# EAGLE design mariokard_v2 (EAGLE 7.2.0)
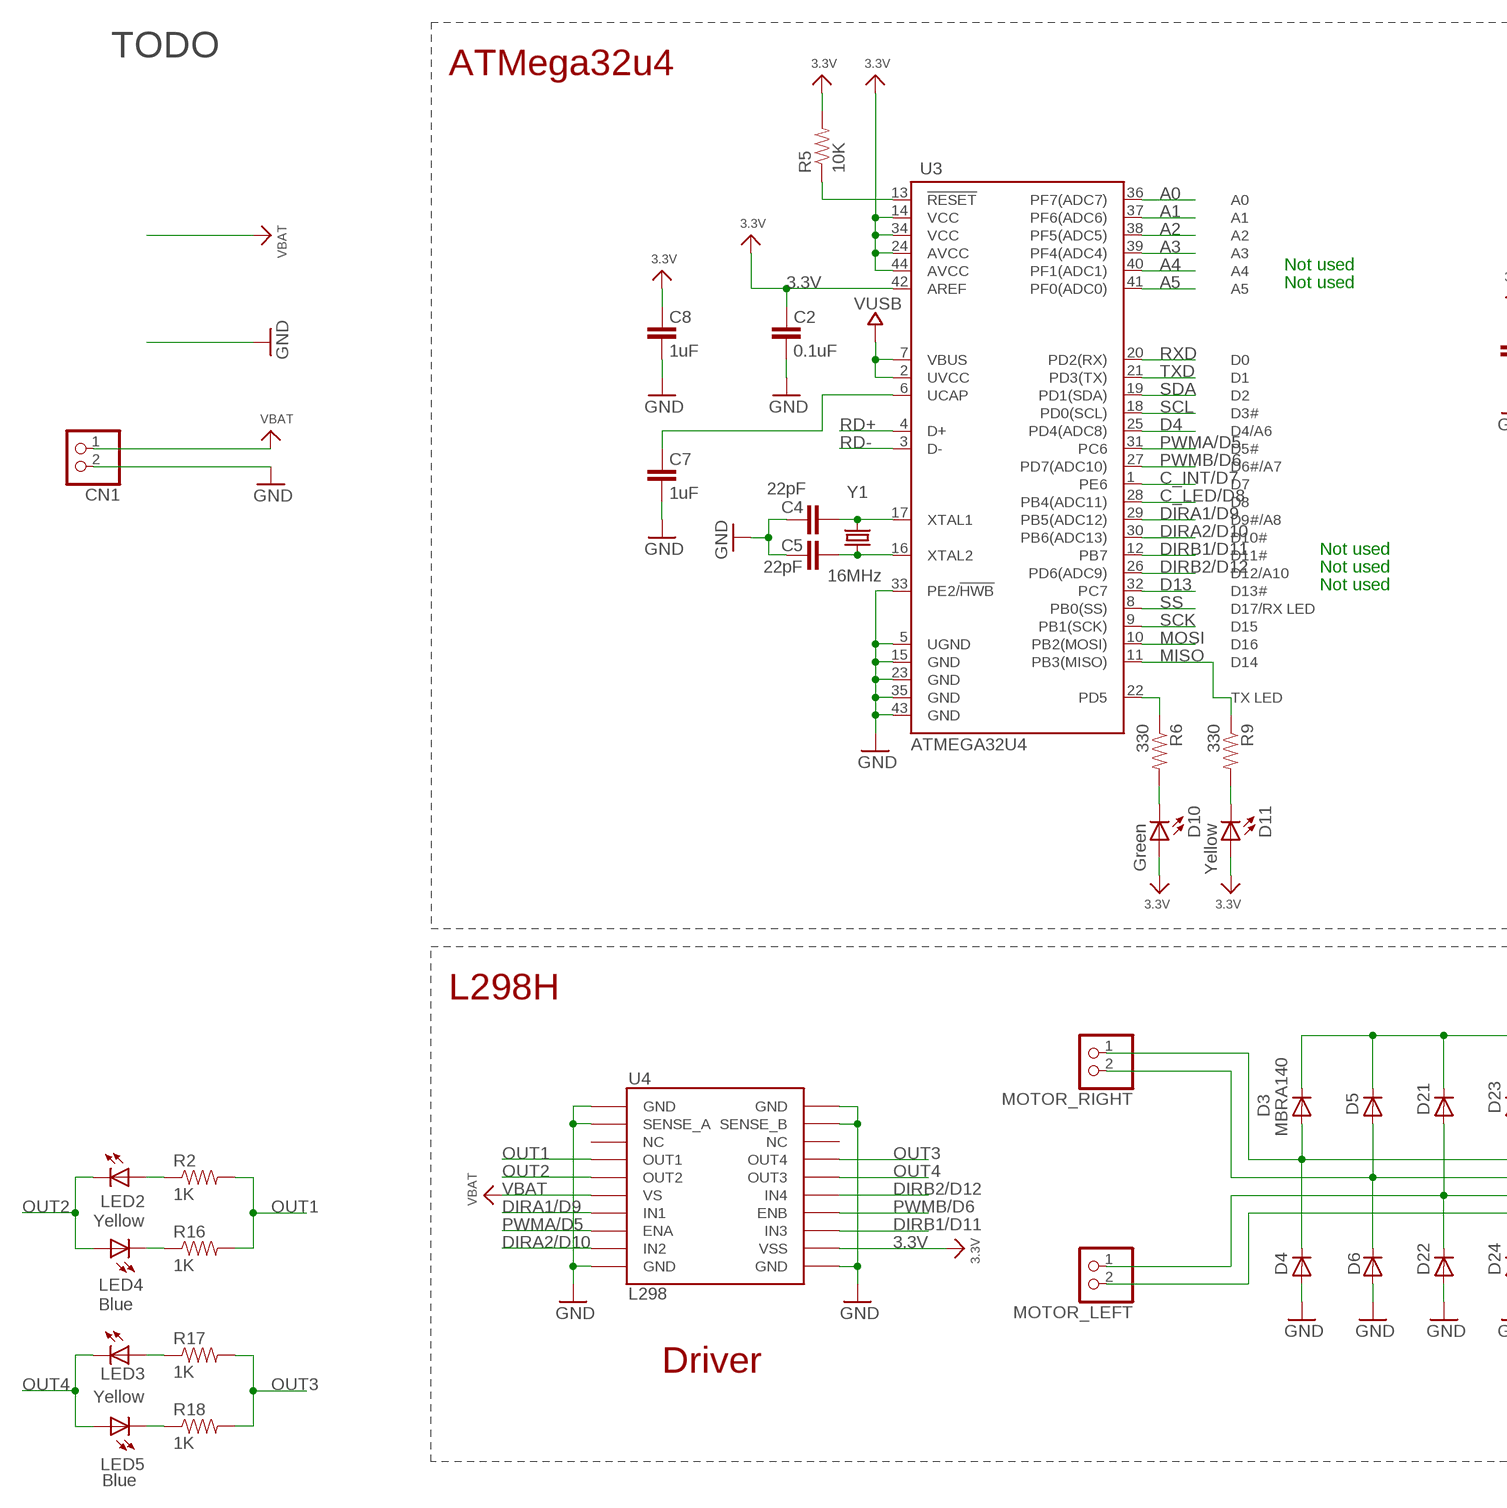
[diagram p0: schematic, sheet 1, part 1 of 2]
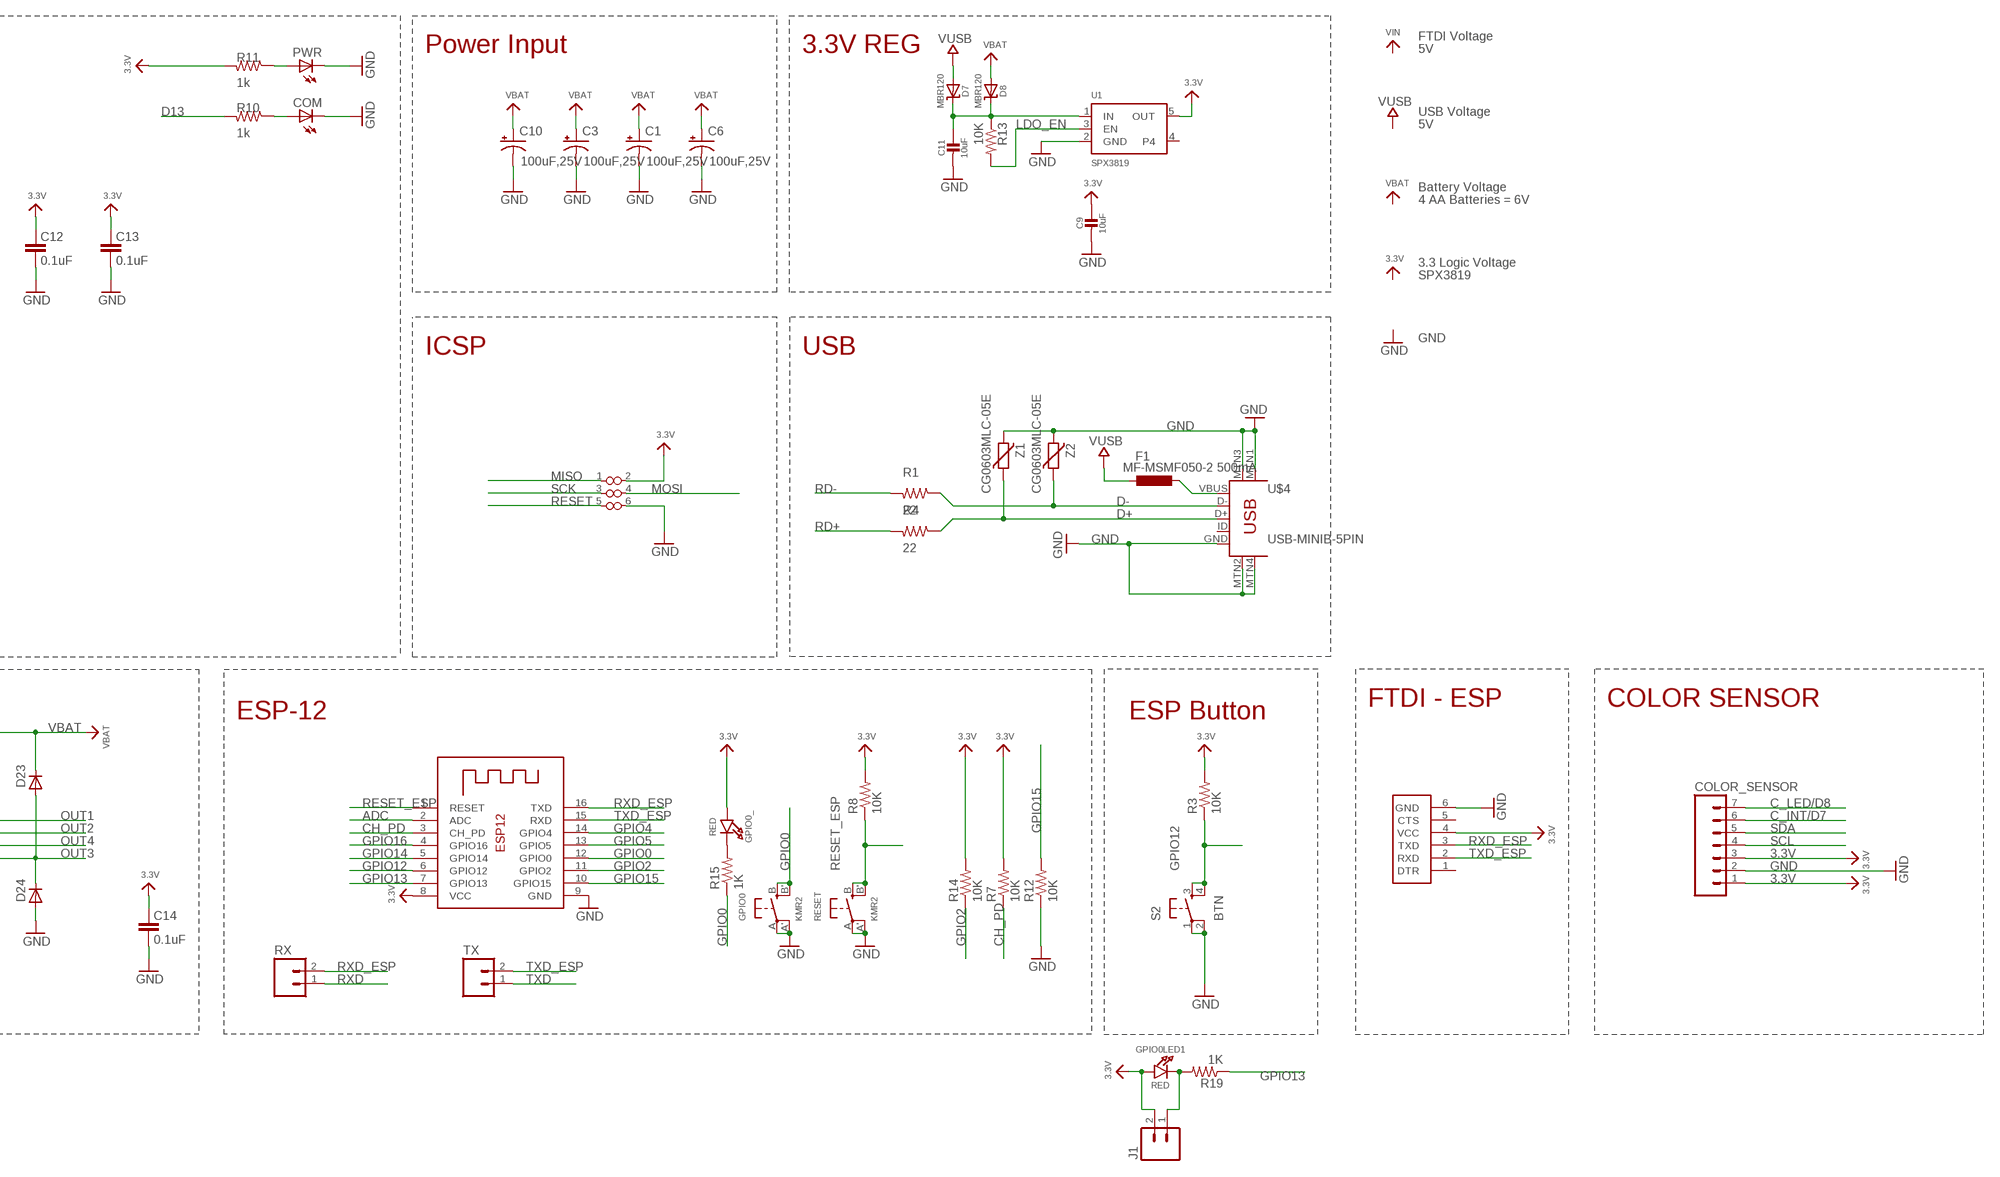
[diagram p1: schematic, sheet 1, part 2 of 2]

## Parts
C1  100uF,25V  CAP_POLF80  [NIPPON_F80]
C2  0.1uF  CAP0603-CAP  [0603-CAP]
C3  100uF,25V  CAP_POLF80  [NIPPON_F80]
C4  22pF  CAP0603-CAP  [0603-CAP]
C5  22pF  CAP0603-CAP  [0603-CAP]
C6  100uF,25V  CAP_POLF80  [NIPPON_F80]
C7  1uF  CAP0603-CAP  [0603-CAP]
C8  1uF  CAP0603-CAP  [0603-CAP]
C9  10uF  CAP_CERAMIC0805-NOOUTLINE  [0805-NO]
C10  100uF,25V  CAP_POLF80  [NIPPON_F80]
C11  10uF  CAP_CERAMIC0805-NOOUTLINE  [0805-NO]
C12  0.1uF  CAP0603-CAP  [0603-CAP]
C13  0.1uF  CAP0603-CAP  [0603-CAP]
C14  0.1uF  CAP0603-CAP  [0603-CAP]
CN1  JST_2PIN-THM  [JST-PH-2-THM]
COLOR_SENSOR  M07  [1X07]
COM  LEDCHIPLED_0603  [CHIPLED_0603]
D3  MBRA140  DIODESMA  [SMA-DIODE]
D4  MBRA140  DIODESMA  [SMA-DIODE]
D5  MBRA140  DIODESMA  [SMA-DIODE]
D6  MBRA140  DIODESMA  [SMA-DIODE]
D7  MBR120  DIODE-SCHOTTKYSOD-123  [SOD-123]
D8  MBR120  DIODE-SCHOTTKYSOD-123  [SOD-123]
D10  Green  LED0603  [LED-0603]
D11  Yellow  LED0603  [LED-0603]
D21  MBRA140  DIODESMA  [SMA-DIODE]
D22  MBRA140  DIODESMA  [SMA-DIODE]
D23  MBRA140  DIODESMA  [SMA-DIODE]
D24  MBRA140  DIODESMA  [SMA-DIODE]
F1  MF-MSMF050-2 500mA  L-EUL1812  [L1812]
FTDI  FTDI_POGO  [FTDI_POGO]
GPIO0  KMR2  SWITCH_TACT_SMT4.6X2.8  [BTN_KMR2_4.6X2.8]
GPIO0_  RED  LED0805_NOOUTLINE  [CHIPLED_0805_NOOUTLINE]
GPIO0LED1  RED  LED0805_NOOUTLINE  [CHIPLED_0805_NOOUTLINE]
ISP  ISP_POGO  [POGO_ISP]
J1  M02PTH  [1X02]
LED2  Yellow  LED0603  [LED-0603]
LED3  Yellow  LED0603  [LED-0603]
LED4  Blue  LED0603  [LED-0603]
LED5  Blue  LED0603  [LED-0603]
MOTOR_LEFT  JST_2PIN-SMT-RA  [JST-PH-2-SMT-RA]
MOTOR_RIGHT  JST_2PIN-SMT-RA  [JST-PH-2-SMT-RA]
PWR  LEDCHIPLED_0603  [CHIPLED_0603]
R1  22  RESISTOR0805-RES  [0805]
R2  1K  RESISTOR0402-RES  [0402-RES]
R3  10K  R-US_R0603  [R0603]
R4  22  RESISTOR0805-RES  [0805]
R5  10K  RESISTOR0603-RES  [0603-RES]
R6  330  RESISTOR0603-RES  [0603-RES]
R7  10K  R-US_R0603  [R0603]
R8  10K  R-US_R0603  [R0603]
R9  330  RESISTOR0603-RES  [0603-RES]
R10  1k  RESISTOR0805-RES  [0805]
R11  1k  RESISTOR0805-RES  [0805]
R12  10K  R-US_R0603  [R0603]
R13  10K  R-US_R0603  [R0603]
R14  10K  R-US_R0603  [R0603]
R15  1K  R-US_R0603  [R0603]
R16  1K  RESISTOR0402-RES  [0402-RES]
R17  1K  RESISTOR0402-RES  [0402-RES]
R18  1K  RESISTOR0402-RES  [0402-RES]
R19  1K  R-US_R0603  [R0603]
RESET  KMR2  SWITCH_TACT_SMT4.6X2.8  [BTN_KMR2_4.6X2.8]
RX  M02PTH  [1X02]
S2  BTN  TAC_SWITCHSMD  [TACTILE-SWITCH-SMD]
TX  M02PTH  [1X02]
U1  SPX3819  VREG_SOT23-5  [SOT23-5]
U3  ATMEGA32U4  ATMEGA32U4TQFP-44  [TQFP44]
U4  L298  L298_BRIDGE_DRIVER  [POWERSO20]
U$4  USB-MINIB-5PIN  [USB-MINIB]
X1  ESP-12  [ESP-12]
Y1  16MHz  CRYSTAL5X3  [CRYSTAL-SMD-5X3]
Z1  CG0603MLC-05E  VARISTORCN0603  [CT/CN0603]
Z2  CG0603MLC-05E  VARISTORCN0603  [CT/CN0603]

## Nets
3.3V: C2.2 C8.2 C9.1 C12.2 C13.2 C14.2 COLOR_SENSOR.1 COLOR_SENSOR.3 D10.A D11.A FTDI.4(VCC) GPIO0_.A GPIO0LED1.A ISP.2(VCC) J1.2 R3.2 R5.2 R7.2 R8.2 R11.2 R14.2 U1.5(OUT) U3.14(VCC) U3.24(AVCC) U3.34(VCC) U3.42(AREF) U3.44(AVCC) U4.P$12(VSS) X1.8(VCC)
A0: U3.36(PF7(ADC7))
A1: U3.37(PF6(ADC6))
A2: U3.38(PF5(ADC5))
A3: U3.39(PF4(ADC4))
A4: U3.40(PF1(ADC1))
A5: U3.41(PF0(ADC0))
ADC: X1.2(ADC)
C_INT/D7: COLOR_SENSOR.6 U3.1(PE6)
C_LED/D8: COLOR_SENSOR.7 U3.28(PB4(ADC11))
CH_PD: R7.1 X1.3(CH_PD)
D4: U3.25(PD4(ADC8))
D13: R10.2 U3.32(PC7)
D+: R4.1 U$4.D+ Z1.1
D-: R1.1 U$4.D- Z2.1
DIRA1/D9: U3.29(PB5(ADC12)) U4.P$7(IN1)
DIRA2/D10: U3.30(PB6(ADC13)) U4.P$9(IN2)
DIRB1/D11: U3.12(PB7) U4.P$13(IN3)
DIRB2/D12: U3.26(PD6(ADC9)) U4.P$15(IN4)
GND: C1.- C2.1 C3.- C4.2 C5.2 C6.- C7.1 C8.1 C9.2 C10.- C11.2 C12.1 C13.1 C14.1 CN1.2 COLOR_SENSOR.2 COM.C D4.A D6.A D22.A D24.A FTDI.6(GND) GPIO0.A'(P1) GPIO0.A(P) ISP.6(GND) PWR.C R12.1 RESET.A'(P1) RESET.A(P) S2.1 S2.2 U1.2(GND) U3.5(UGND) U3.15(GND) U3.23(GND) U3.33(PE2/!HWB) U3.35(GND) U3.43(GND) U4.P$1(GND) U4.P$2(SENSE_A) U4.P$10(GND) U4.P$11(GND) U4.P$19(SENSE_B) U4.P$20(GND) U$4.GND U$4.MTN1(MTN2) U$4.MTN2(MTN3) U$4.MTN3(MTN1) U$4.MTN4 X1.9(GND) Z1.2 Z2.2
GPIO0: GPIO0.B'(S1) GPIO0.B(S) R15.1 X1.12(GPIO0)
GPIO2: R14.1 X1.11(GPIO2)
GPIO4: X1.14(GPIO4)
GPIO5: X1.13(GPIO5)
GPIO12: R3.1 S2.3 S2.4 X1.6(GPIO12)
GPIO13: R19.1 X1.7(GPIO13)
GPIO14: X1.5(GPIO14)
GPIO15: R12.2 X1.10(GPIO15)
GPIO16: X1.4(GPIO16)
LDO_EN: R13.2 U1.3(EN)
MISO: ISP.1(MISO) R9.1 U3.11(PB3(MISO))
MOSI: ISP.4(MOSI) U3.10(PB2(MOSI))
N$1: C5.1 U3.16(XTAL2) Y1.1
N$2: C4.1 U3.17(XTAL1) Y1.3
N$3: C7.2 U3.6(UCAP)
N$4: C11.1 D7.C D8.C R13.1 U1.1(IN)
N$5: LED2.A R2.1
N$6: LED4.C R16.1
N$7: LED5.C R18.1
N$8: LED3.A R17.1
N$9: COM.A R10.1
N$10: PWR.A R11.1
N$11: GPIO0_.C R15.2
N$12: F1.1 U$4.VBUS
N$13: D11.C R9.2
N$14: D10.C R6.2
N$15: GPIO0LED1.C J1.1 R19.2
OUT1: D3.A D4.C MOTOR_RIGHT.1 R2.2 R16.2 U4.P$4(OUT1)
OUT2: D5.A D6.C LED2.C LED4.A MOTOR_RIGHT.2 U4.P$5(OUT2)
OUT3: D23.A D24.C MOTOR_LEFT.2 R17.2 R18.2 U4.P$17(OUT4)
OUT4: D21.A D22.C LED3.C LED5.A MOTOR_LEFT.1 U4.P$16(OUT3)
PWMA/D5: U3.31(PC6) U4.P$8(ENA)
PWMB/D6: U3.27(PD7(ADC10)) U4.P$14(ENB)
RD+: R4.2 U3.4(D+)
RD-: R1.2 U3.3(D-)
RESET: ISP.5(RESET) R5.1 U3.13(!RESET)
RESET_ESP: R8.1 RESET.B'(S1) RESET.B(S) X1.1(RESET)
RXD: RX.1 U3.20(PD2(RX))
RXD_ESP: FTDI.3(TXD) RX.2 X1.16(TXD)
SCK: ISP.3(SCK) U3.9(PB1(SCK))
SCL: COLOR_SENSOR.4 U3.18(PD0(SCL))
SDA: COLOR_SENSOR.5 U3.19(PD1(SDA))
SS: U3.8(PB0(SS))
TXD: TX.1 U3.21(PD3(TX))
TXD_ESP: FTDI.2(RXD) TX.2 X1.15(RXD)
TXLED1: R6.1 U3.22(PD5)
VBAT: C1.+ C3.+ C6.+ C10.+ CN1.1 D3.C D5.C D8.A D21.C D23.C U4.P$6(VS)
VUSB: D7.A F1.2 U3.2(UVCC) U3.7(VBUS)
Unconnected: FTDI.1(DTR) FTDI.5(CTS) U1.4 U4.P$3(NC) U4.P$18(NC) U$4.ID

## Notes on the sheet
- TODO | FTDI Voltage
- ATMega32u4 | Power Input | 3.3V REG | 5V
- USB Voltage
- 5V
- Not used | Battery Voltage
- Not used | 4 AA Batteries = 6V
- 3.3 Logic Voltage
- SPX3819
- GND
- ICSP | USB
- Not used
- Not used
- Not used
- L298H | FTDI - ESP | COLOR SENSOR
- ESP-12 | ESP Button
- Driver

## Library data of the parts
C1 C3 C6 C10 = SparkFun:CAP_POL: Capacitor Polarized These are standard SMD and PTH capacitors. Normally 10uF, 47uF, and 100uF in electrolytic and tantalum varieties. Always verify the external diameter of the through hole cap, it varies with capacity, voltage, and manufacturer. The EIA devices should be standard.
C2 C4 C5 C7 C8 C12-C14 = SparkFun:CAP: Capacitor Standard 0603 ceramic capacitor, and 0.1" leaded capacitor.
C9 C11 = microbuilder:CAP_CERAMIC: Ceramic Capacitors For new designs, use the packages preceded by an '_' character since they are more reliable: The following footprints should be used on most boards: _0402 - Standard footprint for regular board layouts _0603 - Standard footprint for regular board layouts _0805 - Standard footprint for regular board layouts _1206 - Standard footprint for regular board layouts For extremely tight-pitch boards where space is at a premium, the following 'micro-pitch' footprints can be used (smaller pads, no silkscreen outline, etc.): _0402MP - Micro-pitch footprint for very dense/compact boards _0603MP - Micro-pitch footprint for very dense/compact boards _0805MP - Micro-pitch footprint for very dense/compact boards _1206MP - Micro-pitch footprint for very dense/compact boards
CN1 MOTOR_LEFT MOTOR_RIGHT = adafruit:JST_2PIN: JST 2-Pin Connectors of various flavors SMT-RA (S2B-PH-SM4) 4UConnector #17311 SMT (B2B-PH-SM4) THM-RA (S2B-PH) THM (B2B-PH)
COLOR_SENSOR = SparkFun-Connectors:M07: Header 7 Standard 7-pin 0.1" header. Use with straight break away headers (SKU : PRT-00116), right angle break away headers (PRT-00553), swiss pins (PRT-00743), machine pins (PRT-00117), and female headers (PRT-00115). NOTES ON THE VARIANTS LOCK and LOCK_LONGPADS... This footprint was designed to help hold the alignment of a through-hole component (i.e. 7-pin header) while soldering it into place. You may notice that each hole has been shifted either up or down by 0.005 of an inch from it's more standard position (which is usually a perfectly straight line). This slight alteration caused the pins (the squares in the middle) to touch the edges of the holes. Because they are alternating, it causes a "brace" to hold the header in place. 0.005 has proven to be the perfect amount of "off-center" position when using our standard breakaway headers. Although looks a little odd when you look at the bare footprint, once you have a header in there, the alteration is very hard to notice. Also, if you push a header all the way into place, it is covered up entirely on the bottom side. This idea of altering the position of holes to aid alignment will be further integrated into the Sparkfun Library for other footprints. It can help hold any component with 3 or more connection pins.
COM PWR = adafruit:LED: LED
D3-D6 D21-D24 = SparkFun:DIODE: Diode These are standard reverse protection diodes and small signal diodes. SMA package can handle up to about 1A. SOD-323 can handle about 200mA. What the SOD-323 package when ordering, there are some mfgs out there that are 5-pin packages.
D7 D8 = microbuilder:DIODE-SCHOTTKY
D10 D11 LED2-LED5 = SparkFun:LED: LEDs Standard schematic elements and footprints for 5mm, 3mm, 1206, and 0603 sized LEDs. 5mm - Spark Fun Electronics SKU : COM-00529 (and others)
F1 = rcl:L-EU: INDUCTOR, European symbol
FTDI = digikey:FTDI_POGO
GPIO0 RESET = microbuilder:SWITCH_TACT_SMT: SMT Tact Switches 6x6mm - Digikey: P12940SCT-ND KMR2 (4.6x2.8mm) - Digikey: 401-1426-1-ND EVQ-PQHB55 - Light Touch, 160GF (4.5x4.5mm) - Digikey: P8090SCT-ND KMT0 - KMT021 NGJ LHS (etc.) IP68/Waterproof - Digikey: CKN10289CT-ND
GPIO0_ GPIO0LED1 = microbuilder:LED: LED
ISP = digikey:ISP_POGO
J1 RX TX = SparkFun-Connectors:M02: Standard 2-pin 0.1" header. Use with - straight break away headers ( PRT-00116) - right angle break away headers (PRT-00553) - swiss pins (PRT-00743) - machine pins (PRT-00117) - female headers (PRT-00115) Molex polarized connector foot print use with: PRT-08233 with associated crimp pins and housings. 2.54_SCREWTERM for use with PRT-10571. 3.5mm Screw Terminal footprints for PRT-08084 5mm Screw Terminal footprints for use with PRT-08432
R1 R4 R10 R11 = SparkFun-Resistors:RESISTOR: Resistor
R2 R5 R6 R9 R16-R18 = SparkFun:RESISTOR: Resistor
R3 R7 R8 R12-R15 R19 = resistor:R-US_: RESISTOR, American symbol
S2 = SparkFun-Electromechanical:TAC_SWITCH: Momentary Switch Button commonly used for reset or general input. Spark Fun Electronics SKU : COM-00097 SMT- SWCH-08247; PROD_ID: SWCH-08247; VALUE: TAC_SWITCHSMD
U1 = microbuilder:VREG_SOT23-5: SOT23-5 Fixed Voltage Regulators Part Current Out V Out V In V Dropout θJA (°C/W) TJ (°C) Digikey Part No. ADP121 150mA 3.3V 3.4-5.5V 0.09V @ 150mA -- -- ADP121-AUJZ33R7CT-ND ADP121 150mA 3.0V 3.1-5.5V 0.09V @ 150mA -- -- ADP121-AUJZ30R7CT-ND ADP122 300mA 3.3V 3.4-5.5V 0.085V @ 300mA -- -- ADP122AUJZ-3.3-R7CT-ND ADP1712 300mA 3.3V 3.5-5.5V 0.17V @ 300mA -- -- ADP1712AUJZ-3.3-R7TR-ND AP7311 (Low Cost) 150mA 3.3V 3.5-6V 0.15V @ 150mA -- -- AP7311-33WG-7DICT-ND LD39015M18R 150mA 1.8V 1.9V-5.5V 0.08V @ 100mA -- -- 497-6977-1-ND LP2985A-33DBVR 150mA 3.3V 3.3-16V 0.28V @ 150mA 206 150 296-18479-1-ND MCP1824T-3302E/OT 300mA 3.3V 3.5V-6V 0.2V @ 300mA -- -- MCP1824T-3302E/OTCT-ND MIC5205-2.5YM5 TR 150mA 2.5V 2.7-16V 0.165V @ 150mA -- -- 576-1257-2-ND MIC5205-3.0YM5 TR 150mA 3.0V 3.2V-16V 0.165V @ 150mA -- -- 576-1258-2-ND MIC5205-3.3YM5 TR 150mA 3.3V 3.5V-16V 0.165V @ 150mA -- -- 576-1259-2-ND TPS780330220 150mA 3.3V+2.2V 3.6-5.5V 250mV Max -- -- 296-23332-1-ND TDA3663/N1,135 100mA 3.3V 3.5-45V 0.18V @ 50mA -- -- 568-5343-1-ND Max operating temp can be calculated using θJA, TJ (max junction temperature), and power in watts. Set the "Maximum Ambient Temperature" until it reaches TJ ("Max Junction Temperature"), which is the absolute limit for safe use of the regulator: Heat Sink Temperature Calculator <http://www.daycounter.com/Calculators/Heat-Sink-Temperature-Calculator.phtml> For example, With 12V source into a 3.3V LP2985 and a 30mA load, we are dissipating (12V-3.3V) * 0.03A = 0.261W. With a θJA of 206 °C/W, a TJ of 150°C, and 261mW we can safely use the chip without a heat sink up to 75°C (=147.1°C Junction Temperature).
U3 = SparkFun-DigitalIC:ATMEGA32U4: Atmel 44-pin 8-bit Microcontroller with 32KBytes of ISP Flash and USB Controller
U4 = SparkFun:L298_BRIDGE_DRIVER
U$4 = SparkFun-Connectors:USB-MINIB: Mini-USB "B" connector with 5th pin broken out. Created new symbol breaking out 5th "ID" pin in mini/micro USB connector spec. See: http://en.wikipedia.org/wiki/Mini_usb#Cables. Uses same footprint as 4-pin symbol. Also added pins to connect to mounting / shield pads if required (probably not generally needed as signals aren't shielded once they leave the connector).; PROD_ID: CONN-08193
X1 = microbuilder:ESP-12
Y1 = SparkFun:CRYSTAL: Crystals Various standard crystals. Proven footprints. Spark Fun Electronics SKU : COM-00534
Z1 Z2 = varistor:VARISTOR: VARISTOR

## Board
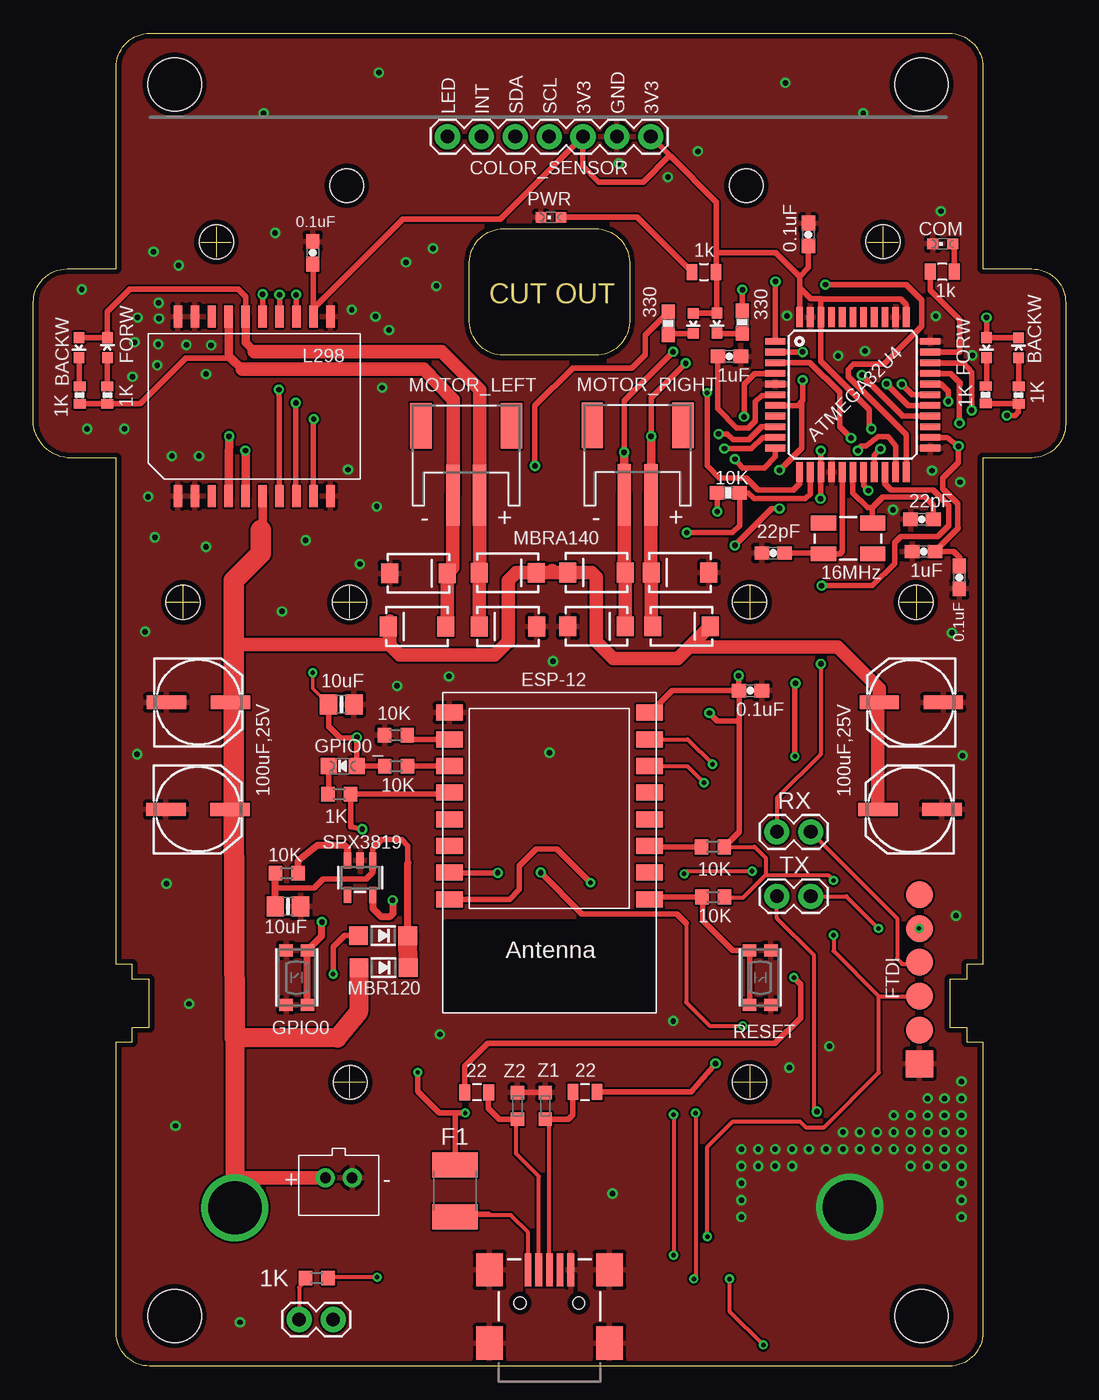
[diagram p2: board, top side]
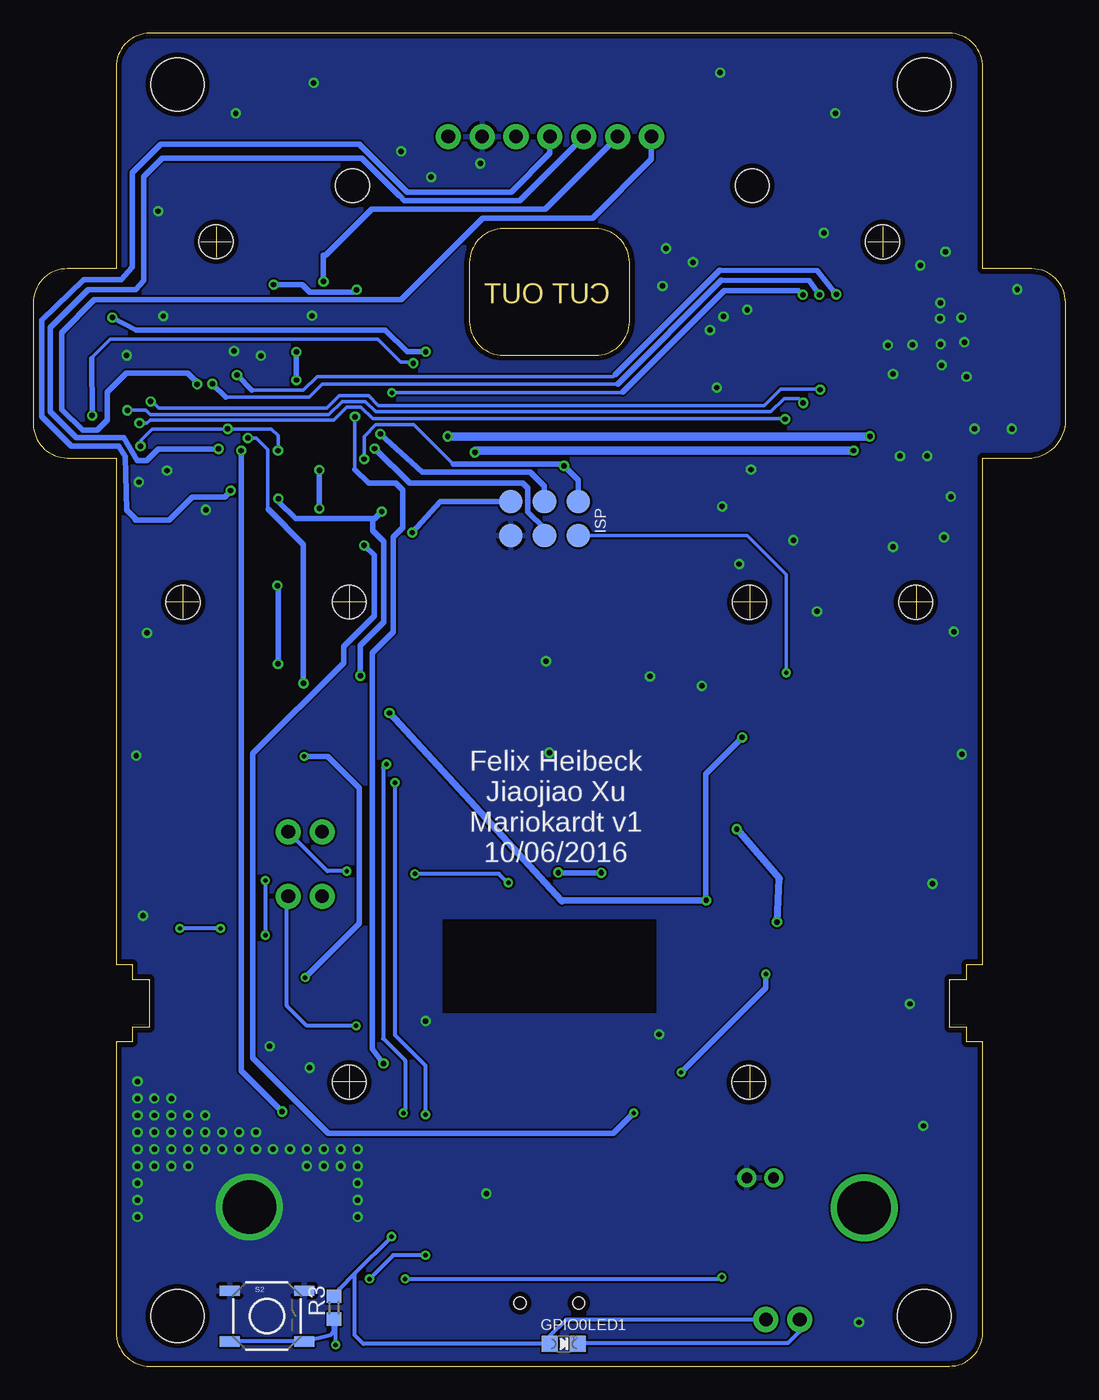
[diagram p3: board, bottom side, seen from below]

Size 77.4 x 99.97 mm. Coordinates in mm from the lower left corner, seen from the top.
Outline: 22.5,21.32 24.9,21.32
Outline: 23.7,22.52 23.7,20.12
Outline: 52.5,21.32 54.9,21.32
Outline: 53.7,22.52 53.7,20.12
Outline: 10,57.32 12.4,57.32
Outline: 11.2,58.52 11.2,56.12
Outline: 22.5,57.32 24.9,57.32
Outline: 23.7,58.52 23.7,56.12
Outline: 52.5,57.32 54.9,57.32
Outline: 53.7,58.52 53.7,56.12
Outline: 65,57.32 67.4,57.32
Outline: 66.2,58.52 66.2,56.12
Outline: 63.7,85.47 63.7,83.17
Outline: 62.55,84.32 64.85,84.32
Outline: 12.55,84.32 14.85,84.32
Outline: 13.7,85.47 13.7,83.17
Outline: 6.2,82.31 6.2,97.41 arc-90 8.74,99.97 68.66,99.97 arc-90 71.2,97.43 71.2,82.31 74.86,82.31 arc-90 77.4,79.77 77.4,70.67 arc-90 74.86,68.13 71.2,68.13 71.2,30.12 70,30.12 70,29.02 68.7,29.02 68.7,25.42 70,25.42 70,24.32 71.2,24.32 71.2,2.54 arc-90 68.66,0 8.74,0 arc-90 6.2,2.53 6.2,24.32 7.4,24.32 7.4,25.42 8.7,25.42 8.7,29.02 7.4,29.02 7.4,30.12 6.2,30.12 6.2,68.13 2.54,68.13 arc-78 0,70.67 0,79.77 arc-90 2.54,82.31 6.2,82.31
Outline: 44.7,82.78 44.7,78.36 arc-90 42.16,75.82 35.24,75.82 arc-90 32.7,78.36 32.7,82.78 arc-90 35.24,85.32 42.16,85.32 arc-90 44.7,82.78
Copper layers (1*16): Top 0.0356mm / dielectric 1.5011mm / Bottom 0.0356mm
Design rules "oshpark-2layer *": minimum track width 6mil, minimum drill 13mil, track to track 6mil, track to pad 6mil, pad to pad 6mil, via to via 6mil, smd to smd 6mil, copper to edge 15mil, drill to drill 6mil, minimum pad ring 7mil, minimum via ring 7mil, stop-mask expansion 2.5mil, vias tented up to drill 16mil, thermal gap 10mil
Holes 2.54 mm at 13.73,84.33 63.7,84.34 11.23,57.29 23.7,57.29 66.18,57.29 53.7,57.32 53.7,21.3 23.75,21.3 23.49,88.54 53.46,88.54
Holes 4 mm at 10.6,96.13 66.6,96.13 66.6,3.75 10.6,3.75

### Footprints (pad centres in the part's own frame; a part is rotated, then mirrored left to right if it is on the bottom)
NIPPON_F80 = smd 2.95 x 1: + 2.4,0; - -2.4,0
0603-CAP = smd 1.1 x 1: 1 -0.85,0; 2 0.85,0
0805-NO = smd 1.3 x 1.5: 1 -0.95,0; 2 0.95,0
JST-PH-2-THM = drill 0.8 pad 1.422: 1 1,0; 2 -1,0
1X07 = drill 1.016 pad 1.88: 1 0,0; 2 2.54,0; 3 5.08,0; 4 7.62,0; 5 10.16,0; 6 12.7,0; 7 15.24,0
CHIPLED_0603 = smd 0.8 x 0.8: A 0,-0.75; C 0,0.75
SMA-DIODE = smd 1.27 x 1.47: A -2.15,0; C 2.15,0
SOD-123 = smd 1.4 x 1.4: A 1.85,0; C -1.85,0
LED-0603 = smd 0.8 x 0.8: A 0,-0.75; C 0,0.75
L1812 = smd 1.9 x 3.4: 1 -1.95,0; 2 1.95,0
FTDI_POGO = smd 2.032 x 2.032: 1 -6.35,0; 2 -3.81,0; 3 -1.27,0; 4 1.27,0; 5 3.81,0; 6 6.35,0
BTN_KMR2_4.6X2.8 = smd 0.9 x 1: A 2.05,0.8; A' -2.05,0.8; B 2.05,-0.8; B' -2.05,-0.8
CHIPLED_0805_NOOUTLINE = smd 1.2 x 1.2: A 0,-1.05; C 0,1.05
POGO_ISP = smd 1.778 x 1.778: 1 -1.27,2.54; 2 1.27,2.54; 3 -1.27,0; 4 1.27,0; 5 -1.27,-2.54; 6 1.27,-2.54
1X02 = drill 1.016 pad 1.88: 1 0,0; 2 2.54,0
JST-PH-2-SMT-RA = smd 1 x 4.6: 1 1,-3.7; 2 -1,-3.7 | smd 1.6 x 3.4: NC1 -3.4,1.5; NC2 3.4,1.5
0805 = smd 0.8 x 1.2: 1 -0.9,0; 2 0.9,0
0402-RES = smd 0.7 x 0.9: 1 -0.65,0; 2 0.65,0
R0603 = smd 1 x 1.1: 1 -0.85,0; 2 0.85,0
0603-RES = smd 1.1 x 1: 1 -0.85,0; 2 0.85,0
TACTILE-SWITCH-SMD = smd 1.524 x 0.762: 1 -2.794,1.905; 2 2.794,1.905; 3 -2.794,-1.905; 4 2.794,-1.905
SOT23-5 = smd 0.55 x 1.2: 1 -0.95,-1.3; 2 0,-1.3; 3 0.95,-1.3; 4 0.95,1.3; 5 -0.95,1.3
TQFP44 = smd 1.5 x 0.5: 1 -5.8,4; 2 -5.8,3.2; 3 -5.8,2.4; 4 -5.8,1.6; 5 -5.8,0.8; 6 -5.8,0; 7 -5.8,-0.8; 8 -5.8,-1.6; 9 -5.8,-2.4; 10 -5.8,-3.2; 11 -5.8,-4; 23 5.8,-4; 24 5.8,-3.2; 25 5.8,-2.4; 26 5.8,-1.6; 27 5.8,-0.8; 28 5.8,0; 29 5.8,0.8; 30 5.8,1.6; 31 5.8,2.4; 32 5.8,3.2; 33 5.8,4 | smd 0.5 x 1.5: 12 -4,-5.8; 13 -3.2,-5.8; 14 -2.4,-5.8; 15 -1.6,-5.8; 16 -0.8,-5.8; 17 0,-5.8; 18 0.8,-5.8; 19 1.6,-5.8; 20 2.4,-5.8; 21 3.2,-5.8; 22 4,-5.8; 34 4,5.8; 35 3.2,5.8; 36 2.4,5.8; 37 1.6,5.8; 38 0.8,5.8; 39 0,5.8; 40 -0.8,5.8; 41 -1.6,5.8; 42 -2.4,5.8; 43 -3.2,5.8; 44 -4,5.8
POWERSO20 = smd 1.651 x 0.635: P$1 -6.731,5.715; P$2 -6.731,4.445; P$3 -6.731,3.175; P$4 -6.731,1.905; P$5 -6.731,0.635; P$6 -6.731,-0.635; P$7 -6.731,-1.905; P$8 -6.731,-3.175; P$9 -6.731,-4.445; P$10 -6.731,-5.715; P$11 6.731,-5.715; P$12 6.731,-4.445; P$13 6.731,-3.175; P$14 6.731,-1.905; P$15 6.731,-0.635; P$16 6.731,0.635; P$17 6.731,1.905; P$18 6.731,3.175; P$19 6.731,4.445; P$20 6.731,5.715
USB-MINIB = smd 2.5 x 0.5: D+ 2.5,0; D- 2.5,0.8; GND 2.5,-1.6; ID 2.5,-0.8; VBUS 2.5,1.6 | smd 2.5 x 2: MTN1 -3,4.5; MTN2 2.5,4.5; MTN3 -3,-4.5; MTN4 2.5,-4.5 | hole 0.9: 0,2.2; 0,-2.2
ESP-12 = smd 2 x 1.2: 1 -7.5,4.5; 2 -7.5,2.5; 3 -7.5,0.5; 4 -7.5,-1.5; 5 -7.5,-3.5; 6 -7.5,-5.5; 7 -7.5,-7.5; 8 -7.5,-9.5; 9 7.5,-9.5; 10 7.5,-7.5; 11 7.5,-5.5; 12 7.5,-3.5; 13 7.5,-1.5; 14 7.5,0.5; 15 7.5,2.5; 16 7.5,4.5
CRYSTAL-SMD-5X3 = smd 1.9 x 1.1: 1 -1.85,-1.15; 2 1.85,-1.15; 3 1.85,1.15; 4 -1.85,1.15
CT/CN0603 = smd 1 x 1: 1 -1,0; 2 1,0

### Placement (x,y rotation side)
C1  12.34,41.76 0 top
C2  53.76,50.67 180 top
C3  65.83,49.79 180 top
C4  66.63,63.52 180 top
C5  55.47,60.98 180 top
C6  12.37,49.79 0 top
C7  52.19,75.74 180 top
C8  66.75,61.1 0 top
C9  23.09,49.64 0 top
C10  65.73,41.76 180 top
C11  19.09,34.5 0 top
C12  58.11,84.89 270 top
C13  69.43,59.16 90 top
C14  20.95,83.51 270 top
CN1  22.9,14.13 180 top
COLOR_SENSOR  46.29,92.23 180 top
COM  68.19,84.18 90 top
D3  48.6,55.5 0 top
D4  48.49,59.53 180 top
D5  42.23,59.52 180 top
D6  42.23,55.49 0 top
D7  26.23,32.3 180 top
D8  26.26,29.9 180 top
D10  51.26,78.23 180 top
D11  49.47,78.21 180 top
D21  35.57,59.51 0 top
D22  35.6,55.48 180 top
D23  28.77,55.48 180 top
D24  28.87,59.47 0 top
F1  31.62,13.15 90 top
FTDI  66.44,29.02 270 top
GPIO0  19.75,29.14 90 top
GPIO0_  23.19,45.01 90 top
GPIO0LED1  37.61,1.67 270 bottom
ISP  39.07,63.58 270 bottom
J1  19.93,3.5 0 top
LED2  73.87,76.39 0 top
LED3  5.55,76.4 0 top
LED4  71.47,76.4 180 top
LED5  3.43,76.4 180 top
MOTOR_LEFT  32.45,69.04 0 top
MOTOR_RIGHT  45.3,69.07 0 top
PWR  38.81,86.17 90 top
R1  33.25,20.55 180 top
R2  73.87,72.83 270 top
R3  54.86,4.39 90 bottom
R4  41.37,20.56 0 top
R5  52.1,65.5 180 top
R6  53.15,78.3 270 top
R7  50.96,38.95 0 top
R8  50.98,35.19 0 top
R9  47.61,78.22 270 top
R10  68.15,82.09 180 top
R11  50.29,82.07 0 top
R12  27.18,47.33 0 top
R13  19,36.97 0 top
R14  27.19,45 180 top
R15  22.93,42.91 180 top
R16  71.4,72.86 270 top
R17  5.55,72.83 270 top
R18  3.47,72.83 270 top
R19  21.26,6.62 180 top
RESET  54.5,29.14 270 top
RX  55.75,40.07 0 top
S2  59.89,3.76 0 bottom
TX  55.75,35.25 0 top
U1  24.5,36.64 180 top
U3  61.45,72.87 0 top
U4  16.55,71.99 90 top
U$4  38.7,4.73 90 top
X1  38.69,39.51 180 top
Y1  61.09,62.09 0 top
Z1  38.38,19.52 90 top
Z2  36.3,19.52 90 top

### Tracks (layer width: path | path; a pad name or v marks a point on that pad's centre or on a via)
3.3V  (via drill 0.33, 0.41)
  Top 0.254: v20.95,52.01 20.95,50.83 C9.1
  Top 0.305: v50.54,9.72 50.54,16.45 52.45,18.36 57.47,18.36 57.9,17.93 59.3,17.93 63.4,22.03 63.4,27.73 | R7.2 54.08,38.95 54.9,38.13 54.9,36.83 | 54.9,36.83 53.2,35.13 51.89,35.13 R8.2 | 54.9,36.83 59.6,36.83 v60,36.43 | v60,32.33 60,31.13 63.4,27.73 | 63.4,27.73 66.43,27.73 FTDI.4
  Top 0.406: 26.36,45.08 26.34,45.06 R14.2 GPIO0_.A 24.25,45.02 v24.25,47.16 24.2,47.11 23.01,47.11 22.14,47.98 C9.1 | R5.2 51.28,65.47 v51.28,64.1 | v59.03,65.07 59.05,65.09 U3.14 v59.05,68.67 | R11.2 51.25,82.14 | 57.45,80.9 U3.44 | R11.2 51.26,82 D10.A 49.5,78.98 D11.A | R8.2 51.81,35.21 | U3.24 | U3.24 67.27,69.64 68.52,69.64 v69.36,69 69.36,67.78 68.19,66.62 68.19,65.83 69.31,64.71 69.31,62.91 69.36,62.86 C8.2 69.01,61.1 69.46,60.65 69.46,60.05 C13.2 | C2.2 52.87,50.67 52.88,50.67 v52.88,51.78 | 59.05,80.05 U3.42 59.03,78.64 59.03,75.38 62.66,71.75 62.66,70.48 v62.84,70.3 | 59.05,80.05 58.29,80.05 57.45,80.9 | U3.34 65.45,79.63 65.04,80.03 59.08,80.03 59.05,80.05 | 51.2,83.51 51.2,87.32 47.74,90.78 | 51.2,83.51 51.2,82.08 R11.2 | 57.45,80.9 57.45,81.73 | 57.45,81.73 55.67,83.51 51.2,83.51 | R7.2 52.91,40.05 52.91,48.4 | 52.91,48.4 C2.2 | 46.22,48.99 47.9,50.67 C2.2 | v50.69,48.99 51.28,48.4 52.91,48.4 | 21,79.32 27.69,86.01 35,86.01 COLOR_SENSOR.3 41.23,92.21 41.2,92.18 41.2,90.03 42.41,88.82 45.73,88.82 47.68,90.78 47.74,90.78 | COLOR_SENSOR.1 47.74,90.78 | 21,79.32 U4.P$12 | C12.2 58.11,82.4 57.45,81.73 | 21,79.32 21,82.61 C14.2
  Top 0.508: U1.5 25.45,34.33 26.03,33.75 26.77,33.75 26.97,33.95 26.97,34.92 v26.94,34.94 | 46.22,48.99 X1.8
  Bottom 0.254: v59.05,68.67 59.05,69.79 59.56,70.3 v62.84,70.3 68.47,70.3 69.36,69.41 v69.36,69 | ISP.2 23.88,62.31 20.95,59.38 v20.95,52.01
  Bottom 0.305: J1.2 37.46,3.5 38.73,2.23 38.73,1.74 GPIO0LED1.A 52.65,1.67 53.34,2.35 53.34,6.93 | v50.54,9.72 53.34,6.93 | 53.34,6.93 54.48,5.78 54.48,5.62 R3.2 | v60,36.43 v60,32.33
  Bottom 0.406: 27,34.94 27,44.42 v24.25,47.16 | v51.28,64.1 51.81,63.57 51.94,63.57 | 51.94,63.57 57.73,63.57 59.03,64.86 v59.03,65.07 | v52.88,51.78 52.88,54.07 51.13,55.82 51.13,61.84 51.97,62.68 51.97,63.54 51.94,63.57
  Bottom 0.508: v26.94,34.94 27,34.94 37.77,34.89 v50.69,48.99
C_INT/D7  (via drill 0.41)
  Top 0.406: v55.65,81.35 55.65,80.69 U3.1
  Bottom 0.406: v55.65,81.35 55.65,83.33 55.47,83.33 52.01,86.79 39.04,86.79 COLOR_SENSOR.6
C_LED/D8  (via drill 0.41)
  Top 0.406: U3.28 65.86,72.86 65.86,72.92 v65.12,73.65
  Bottom 0.406: v65.12,73.65 65.12,73.78 65.83,74.49 70.43,74.49 71.85,73.07 71.85,70.98 72.61,70.21 73.71,70.21 75.26,71.76 75.26,77.54 72.82,79.98 49.83,79.98 43.69,86.12 35.46,86.12 31.05,90.53 COLOR_SENSOR.7
CH_PD
  Top 0.406: X1.3 46.26,38.95 R7.1
D13
  Top 0.406: R10.2 67.25,80.71 69.46,78.5 69.46,76.09 69.44,76.06 U3.32
D+
  Top 0.305: U$4.D+ 38.7,18.2 Z1.1
  Top 0.406: Z1.1 40.11,18.52 40.46,18.86 R4.1
D-
  Top 0.305: U$4.D- 37.9,14.23 36.19,15.94 36.19,18.41
  Top 0.406: R1.1 34.11,20.5 34.11,19.35 34.93,18.52 Z2.1 36.19,18.41
DIRA1/D9  (via drill 0.41)
  Top 0.406: U4.P$7 18.46,72.28 v18.41,73.25 | v68.6,72.36 68.6,73.12 68.07,73.65 U3.29
  Bottom 0.254: v18.41,73.25 18.46,73.3 21.36,73.3 22.6,72.05 51.53,72.05 52.27,72.79 54.48,72.79 55.42,71.85 67.99,71.85 68.5,72.36 v68.6,72.36
DIRA2/D10  (via drill 0.41)
  Top 0.406: U4.P$9 21,70.75 v21.03,71.04 | v69.44,70.73 69.44,73.6 69.52,73.68 69.52,73.73 68.78,74.47 U3.30
  Bottom 0.254: v21.03,71.04 21.05,71.06 51.96,71.06 52.85,71.95 53.89,71.95 54.88,70.96 68.65,70.96 68.88,70.73 v69.44,70.73
DIRB1/D11  (via drill 0.33, 0.41)
  Top 0.406: U4.P$13 19.71,78.74 v19.71,80.36 | v50.52,73.02 50.52,67.53 51.43,66.62 53.46,66.62 54.35,65.73 56.97,65.73 57.45,66.21 U3.12
  Bottom 0.254: 33.22,73.04 33.24,73.02 v50.52,73.02
  Bottom 0.406: v19.71,80.36 20.04,80.69 25.6,80.69 33.22,73.04
DIRB2/D12  (via drill 0.41)
  Top 0.406: U4.P$15 17.17,78.74 v17.19,80.38 | U3.26 65.2,71.26 v62.12,74.34
  Bottom 0.254: 33.78,74.36 33.9,74.24 56.13,74.24 57.15,73.22 61.01,73.22
  Bottom 0.406: v17.19,80.38 18.64,82.19 25.93,82.21 33.78,74.36 | 62.1,74.36 v62.12,74.34 | 61.92,74.13 v62.12,74.34 | 61.01,73.22 v62.12,74.34
GND  (via drill 0.41, 4)
  Top 0.406: Z2.2 Z1.2
  other vias: 9.01,83.58 68.04,86.63 60.35,75.79 70.4,75.81 67.66,78.76 56.51,78.78 7.82,78.66 9.39,79.75 9.42,78.58 9.37,76.65 13.33,76.57 11.48,76.6 9.29,75.07 7.59,76.8 7.44,74.21 10.89,82.57 3.63,80.76 18.13,85.01 29.97,83.84 31.16,51.73 38.71,46.02 64.46,64.23 67.38,67.18 69.49,66.31 62.35,76.14 69.59,16.27 68.32,16.27 67.05,16.27 65.78,16.27 56.89,16.27 55.62,15 55.62,16.27 54.35,16.27 54.35,15 69.59,15 69.59,13.73 69.59,11.19 53.08,16.27 53.08,15 53.08,13.73 53.08,12.46 69.59,17.54 68.32,17.54 67.05,17.54 65.78,17.54 63.24,16.27 61.97,16.27 60.7,16.27 59.43,16.27 58.16,16.27 56.89,15 69.59,18.81 67.05,18.81 65.78,18.81 63.24,17.54 60.7,17.54 53.08,11.19 69.59,21.35 61.97,17.54 64.51,16.27 64.51,18.81 67.05,20.08 68.32,20.08 69.59,20.08 64.51,17.54 65.78,15 67.05,15 68.32,15 43.88,90.22 47.57,89.18 49.83,91.12 68.32,18.81 69.59,12.46 6.83,70.3 4.03,70.3 8.61,65.22 10.38,68.27 12.42,68.27 9.11,62.17 23.59,67.25 27.28,51.02 24.48,60.17 25.75,64.48 20.42,61.94 18.64,56.61 56.68,22.39 47.98,25.89 59.68,23.99 69.18,33.79 68.88,54.99 9.98,36.19 8.38,55.09 7.78,45.89 69.68,45.79 61.2,11.93 23.87,79.24 25.65,78.73 26.67,77.72 30.22,81.02 27.94,82.8 26.16,73.4 12.95,74.41 12.95,61.46 17.27,93.97 56.38,96.26 43.43,12.95 10.66,18.03 15.49,3.29 30.48,24.88 11.68,27.17 62.23,93.97 25.9,97.02 38.96,52.88
  pour Top: -5.29,104.39 79.04,104.39 79.04,-7.88 -5.29,-7.88
  pour Bottom: -3.41,100.53 78.89,100.53 78.89,-1.73 -3.41,-1.73
GPIO0  (via drill 0.41)
  Top 0.406: X1.12 31.08,42.91 R15.1 23.78,40.44 v24.66,40.28
  Top 0.508: GPIO0.B' GPIO0.B 21.61,32.25 v21.64,33.32
  Bottom 0.508: v21.64,33.32 21.46,36.57 v24.66,40.28
GPIO2
  Top 0.406: R14.1 X1.11
GPIO12  (via drill 0.33)
  Top 0.305: X1.6 49.03,45.01 v50.29,43.76 | v48,18.86 v48,8.32 | v52.19,6.55 52.19,4.13 v54.73,1.59
  Bottom 0.305: v50.29,43.76 50.29,24.83 48,22.55 v48,18.86 | v48,8.32 50.41,8.32 v52.19,6.55 | S2.3 S2.4 55.11,2.35 54.86,2.61 R3.1 54.73,3.41 v54.73,1.59
GPIO13  (via drill 0.33)
  Top 0.305: X1.7 49.06,47.01 v50.92,45.15 | v49.65,18.99 49.65,6.67 v49.53,6.55 | v25.78,6.67 22.16,6.67 R19.1
  Bottom 0.305: v50.92,45.15 51.18,44.9 51.18,24.58 49.53,22.93 49.53,19.25 v49.65,18.99 | v49.53,6.55 25.9,6.55 v25.78,6.67
GPIO15
  Top 0.406: X1.10 28.09,47.01 R12.2
LDO_EN
  Top 0.508: R13.2 19.86,37.95 21.31,39.08 23.31,39.08 23.54,38.85 U1.3
MISO  (via drill 0.41)
  Top 0.406: v37.61,67.53 37.61,72.05 40.43,74.87 44.85,74.87 45.87,75.89 45.87,77.33 R9.1 | U3.11 55.65,68.22 54.81,67.38 53.18,67.38 v52.6,68.04
  Bottom 0.254: v52.6,68.04 52.6,69.74 51.74,70.6 48.87,70.6 45.92,67.66
  Bottom 0.406: ISP.1 36.53,66.45 v37.61,67.53 37.74,67.66 45.92,67.66
MOSI  (via drill 0.41)
  Top 0.406: v51.81,68.83 53.84,68.83 54.68,69.66 U3.10 | U3.10
  Bottom 0.406: ISP.4 39.07,62.82 40.33,64.08 40.33,65.88 40.69,66.24 49.2,66.24 v51.81,68.83
N$1
  Top 0.406: C5.1 59.2,60.98 Y1.1 59.25,60.93 60.47,60.93 60.65,61.1 U3.16
N$2
  Top 0.406: C4.1 67.46,63.54 67.46,64.58 66.87,65.17 63.67,65.17 62.89,64.38 | 62.89,64.38 Y1.3 | U3.17 61.44,65.5 62.55,64.38 62.89,64.38
N$3
  Top 0.406: U3.6 55.59,72.81 54.61,72.81 54.12,72.33 54.12,70.88 53.61,70.38 52.75,70.38 51.3,71.82 51.3,75.7 C7.2
N$4
  Top 0.406: U1.1 25.45,38.83 26.13,39.51 27.61,39.51 28.09,39.03 28.09,37.76 28.08,37.75 | R13.1 18.13,36.95 18.13,35.86 21.05,35.86 21.74,36.54 24.96,36.54 25.45,37.03 25.45,37.2
  Top 0.508: D7.C 28.08,37.75 | C11.1 18.14,36.96 R13.1 | 25.45,37.2 U1.1
  Top 1.422: D8.C 28.11,29.96 D7.C
N$5
  Top 0.406: R2.1 LED2.A
N$6
  Top 0.406: R16.1 71.47,73.51 LED4.C
N$7
  Top 0.406: R18.1 3.43,73.53 LED5.C
N$8
  Top 0.406: R17.1 5.55,73.89 LED3.A
N$9
  Top 0.406: COM.A 69.05,84.18 R10.1
N$10
  Top 0.406: R11.1 45.29,86.17 PWR.A
N$11
  Top 0.406: GPIO0_.C 22.14,42.96 R15.2
N$12
  Top 0.305: U$4.VBUS 37.1,10.03 35.8,11.33 34.2,11.33 34.16,11.37
  Top 0.406: 34.16,11.37 31.62,11.37 F1.1
N$13
  Top 0.406: R9.2 47.7,77.46 D11.C
N$14
  Top 0.406: D10.C 51.28,77.45 R6.2
N$15
  Top 0.305: R19.2 20.41,6.38 19.93,5.91 J1.1
  Bottom 0.305: J1.1 19.93,2.61 20.82,1.72 36.51,1.72 GPIO0LED1.C
OUT1  (via drill 0.41)
  Top 0.406: R16.2 73.87,72.21 R2.2 73.86,71.56 73.6,71.31 v73,71.31 | v46.33,69.74 46.33,72.64 v48.92,75.23
  Top 0.635: U4.P$4 14.65,67.91 v14.68,69.74 | v46.33,69.74 MOTOR_RIGHT.1
  Top 1.016: 46.33,59.54 D4.C | D4.C 46.34,55.6 D3.A | MOTOR_RIGHT.1 46.3,59.57 D4.C
  Bottom 0.254: v48.92,75.23 48.99,75.3 49.86,75.3 51.58,77.03 71.62,77.03 73.02,75.63 73.02,75.58
  Bottom 0.406: v73,71.31 73.02,75.58
  Bottom 0.635: v14.68,69.74 v46.33,69.74
OUT2  (via drill 0.41)
  Top 0.406: LED2.C 71.47,77.14 | 71.47,77.14 LED4.A | 71.47,77.14 LED4.A v71.47,78.66 | v44.29,68.55 44.29,72.41 v47.98,76.09
  Top 0.635: U4.P$5 15.92,68.44 v15.9,68.67 | v44.29,68.55 MOTOR_RIGHT.2
  Top 1.016: 44.33,59.57 D5.A | D5.A D6.C | MOTOR_RIGHT.2 44.3,59.6 D5.A
  Bottom 0.406: v71.47,78.66 69.67,77.69 51.02,77.69 49.37,76.09 v47.98,76.09
  Bottom 0.635: v15.9,68.67 44.22,68.67 v44.29,68.55
OUT3
  Top 0.406: 14.8,75.6 11.44,75.6 8.03,72.18 R17.2 R18.2
  Top 0.635: U4.P$17 14.65,75.74 14.8,75.6 15.67,74.77
  Top 1.016: 31.45,59.9 D24.C | D24.C 31.02,55.89 D23.A | D24.C 31.45,59.9 MOTOR_LEFT.2 31.49,65.37 31.49,72.48 29.26,74.77 15.67,74.77
OUT4
  Top 0.406: U4.P$16 15.92,80.21 15.36,80.76 7.23,80.76 5.55,79.08 LED3.C LED5.A
  Top 0.635: U4.P$16 15.92,76.76 16.58,76.09
  Top 1.016: 33.45,59.54 D21.A | D21.A 33.42,55.89 D22.C | D21.A 33.45,59.54 MOTOR_LEFT.1 33.47,65.36 33.47,73.25 30.63,76.09 16.58,76.09
PWMA/D5  (via drill 0.41)
  Top 0.254: U4.P$8 19.71,65.28
  Top 0.406: v70.35,71.7 70.35,74.54 69.77,75.23 67.28,75.23 U3.31 | 19.71,65.28 19.68,65.31 v19.68,72.26
  Bottom 0.254: v19.68,72.26 20.01,72.59 21.1,72.59 22.09,71.59 51.74,71.59 52.5,72.36 54.25,72.36 55.24,71.37 68.63,71.37 68.96,71.7 v70.35,71.7
PWMB/D6  (via drill 0.41)
  Top 0.406: U4.P$14 v18.46,80.36 | U3.27 65.59,72.06 v63.98,73.68
  Bottom 0.254: 33.6,73.68 55.72,73.68 56.71,72.69 62.99,72.69
  Bottom 0.406: v18.46,80.36 19.22,81.42 25.83,81.45 33.6,73.68 | 62.99,72.69 v63.98,73.68
RD+  (via drill 0.41)
  Top 0.406: R4.2 49.32,20.56 v51.15,22.7 | U3.4 54.07,74.47 53.28,73.68 v53.28,71.21
  Bottom 0.254: v53.28,71.21 53.28,67.25
  Bottom 0.406: v51.15,22.7 51.99,23.79 51.99,53.48 50.41,55.06 50.41,62.2 49.7,62.91 49.7,65.73 50.21,66.24 52.27,66.24 53.28,67.25
RD-  (via drill 0.33, 0.41)
  Top 0.406: R1.2 32.35,22.49 34.06,24.2 55.6,24.2 57.53,26.13 57.53,28.64 v57.02,29.15 | v57.15,51.22 57.09,51.17 v57.09,45.74 | U3.3 55.66,75.28 58.21,75.28 60.45,73.04 60.45,70.48 v61.31,69.61
  Bottom 0.254: 59.79,64.28 59.81,64.31 59.81,68.75 60.68,69.61 v61.31,69.61
  Bottom 0.406: v57.15,51.22 57.15,61.64 59.79,64.28 | v57.09,45.74 55.32,45.74 52.95,43.38 52.95,33.22 v57.02,29.15
RESET  (via drill 0.41)
  Top 0.406: v48.99,62.53 52.42,62.53 52.95,63.06 R5.1 53.61,65.5 54.05,65.07 57.88,65.07 58.24,65.42 U3.13
  Bottom 0.406: ISP.5 46.9,64.85 v48.99,62.53
RESET_ESP
  Top 0.406: X1.1 46.37,35.19 R8.1 50.18,35.14 50.18,33.45 52.45,31.18 53.57,31.18 RESET.B' RESET.B
RXD  (via drill 0.41)
  Top 0.305: 59.03,52.65 59.03,45.89 55.75,42.61 RX.1
  Top 0.406: v59.1,58.54 62.91,58.54 64.59,60.22 64.59,61.77 65.04,62.22 67.81,62.22 68.65,63.06 68.65,64.56 67.48,65.73 64.31,65.73 63.85,66.18 U3.20 | 59.03,52.65 v59.05,52.67
  Bottom 0.406: v59.05,52.67 59.05,58.49 v59.1,58.54
RXD_ESP  (via drill 0.33)
  Top 0.305: RX.2 64.77,33.6 64.77,30.55 65.15,30.17 66.32,30.17 FTDI.3 | v48.8,36.93 49,37.13 v53.9,37.13
  Top 0.406: X1.16 35.7,35.01 36.44,35.76 36.44,37.53 37.71,38.8 39.24,38.8 v41.78,36.26
  Bottom 0.305: v41.78,36.26 41.83,36.26 42.5,36.93 v48.8,36.93 | v53.9,37.13 55.35,37.13 RX.2
SCK  (via drill 0.41)
  Top 0.406: U3.9 55.63,70.48 54.63,70.48 53.64,69.49 52.47,69.49 52.04,69.92 v51.38,69.92
  Bottom 0.406: ISP.3 39.1,66.02 40.13,67.05 48.23,67.07 v51.38,69.92
SCL  (via drill 0.41)
  Top 0.406: U3.18 62.25,66.04 v62.61,65.68
  Bottom 0.406: v62.61,65.68 62.61,65.65 63.06,65.19 65.48,65.19 67.2,63.47 69.77,63.47 69.77,63.58 70.41,64.22 70.51,68.23 71.01,69.03 74.57,69.03 76.76,71.22 76.76,78.45 73.6,81.51 70.8,81.51 69.98,82.43 69.98,89.51 67.84,91.64 52.92,91.64 52.92,91.63 49.35,88.06 41.58,88.06 38.67,90.97 COLOR_SENSOR.4
SDA  (via drill 0.41)
  Top 0.406: U3.19 63.04,67.07 63.04,68.32 v63.52,68.8
  Bottom 0.406: v63.52,68.8 68.04,68.8 68.91,67.94 69.6,67.94 70.61,69.65 74.18,69.65 76.14,71.61 76.14,77.91 73.3,80.75 69.72,80.75 69.13,81.43 69.13,89.23 67.74,90.62 52.78,90.62 49.96,87.79 49.94,87.79 49.58,87.43 40.93,87.43 COLOR_SENSOR.5
TXD  (via drill 0.41)
  Top 0.305: v58.75,19.09 58.54,19.3 58.54,30.8 55.75,33.6 TX.1
  Top 0.406: v61.82,68.67 61.97,68.9 62.07,69 62.43,69 63.34,69.74 64.11,69.72 64.65,69.02 U3.21
  Bottom 0.406: v61.82,68.67 61.82,22.17 v58.75,19.09
TXD_ESP  (via drill 0.33, 0.41)
  Top 0.305: TX.2 60.96,35.25 v63.37,32.83 | v66.42,32.83 FTDI.2 | 48.94,33.22 48.94,27.29 50.7,25.53 v53.2,25.53
  Top 0.406: X1.15 31.21,37 v34.82,37 | v38.04,37.03 41.12,33.93 48.23,33.93 48.94,33.22
  Bottom 0.305: v63.37,32.83 v66.42,32.83 | v53.2,25.53 56.9,25.53 58.4,27.03 58.4,35.14 TX.2
  Bottom 0.406: v34.82,37 38.02,37 v38.04,37.03
TXLED1  (via drill 0.41)
  Top 0.406: U3.22 65.45,69.87 61.08,74.24 61.08,74.74 61.49,75.15 63.75,75.15 66.62,78.02 66.62,79.95 65.45,81.12 v59.38,81.12 | v53.16,80.74 R6.1
  Bottom 0.406: v59.38,81.12 57.25,81.12 56.69,80.56 53.34,80.56 v53.16,80.74
VBAT  (via drill 4)
  Top 0.406: C1.+ 14.74,42.63 15.03,42.92 | C6.+ 14.77,47.5 15.03,47.24 | 15.11,13.91 v15.11,11.88
  Top 0.635: U4.P$6 17.19,62.85 17.06,62.73
  Top 1.016: 38.74,59.51 D21.C 36.2,59.51 35.61,58.92 35.61,54.35 34.59,53.33 27.48,53.33 26.72,54.09 26.72,54.15 | 38.74,59.51 40.06,59.51 D5.C 41.86,59.52 42.21,59.17 42.21,54.35 43.48,53.08 48.33,53.08 49.19,53.94 | 38.74,59.51 38.91,59.68 | D23.C 26.72,55.87 26.72,54.15 | 49.19,53.94 D3.C | 26.72,54.15 26.74,54.12 15.13,54.12 15.03,54.22 | C10.+ 63.33,50 C3.+ 63.43,50.81 60.3,53.94 49.19,53.94 | CN1.1 15.33,14.13 15.11,13.91
  Top 1.422: D8.A 24.39,26.57 22.79,24.62 15.08,24.63 15.11,24.63 15.11,13.91
  Top 1.524: 15.08,24.63 15.03,42.92 15.03,47.24 15.03,54.22 15.03,58.92 17.06,60.95 17.06,62.73
VUSB  (via drill 0.33, 0.41)
  Top 0.406: U3.2 v57.68,76.06 v57.68,76.07 | v57.68,73.96 57.68,72.43 57.63,72.38 | 57.63,72.38 57.3,72.05 U3.7 | 57.63,72.38 57.63,68.88 v55.95,67.2 | v52.6,61.56 55.37,64.33 v55.95,64.33 | v32.38,18.99 31.62,18.99 | 31.62,18.99 30.43,18.99 28.82,20.6 v28.82,22.04 | D7.A 23.34,32.3 22.47,31.44 v22.47,29.41 | F1.2 31.62,18.99
  Bottom 0.406: v57.68,76.07 v57.68,73.96 | v55.95,67.2 v55.95,64.33 | v52.6,61.56 52.57,61.56 51.84,60.83 51.84,56.25 54.12,53.97 54.12,52.75 60.93,45.94 60.93,23.11 55.29,17.47 33.9,17.47 v32.38,18.99 | v22.47,29.41 22.47,28.39 v28.82,22.04

### Text on the board
Dimension: CUT OUT
tNames: LED | INT | SDA | SCL | 3V3 | GND | 3V3
bNames: Felix Heibeck | Jiaojiao Xu | Mariokardt v1 | 10/06/2016
Document: DONE | CHANGES
tDocu: PWR LED to GND | VUSB to Voltage Reg (instead of VIN) | ISP connections | ESP FTDI to top | Jumper for ESP | MAKE WINGS SMALLER | OVERHANGS FOR CASE | GPIO Button ESP | have to fix slot | LED jumper | jstg header | make 4mm holes for battery | 0.1uF caps